# EAGLE schematic tm8_XP1 (EAGLE 9.6.2)
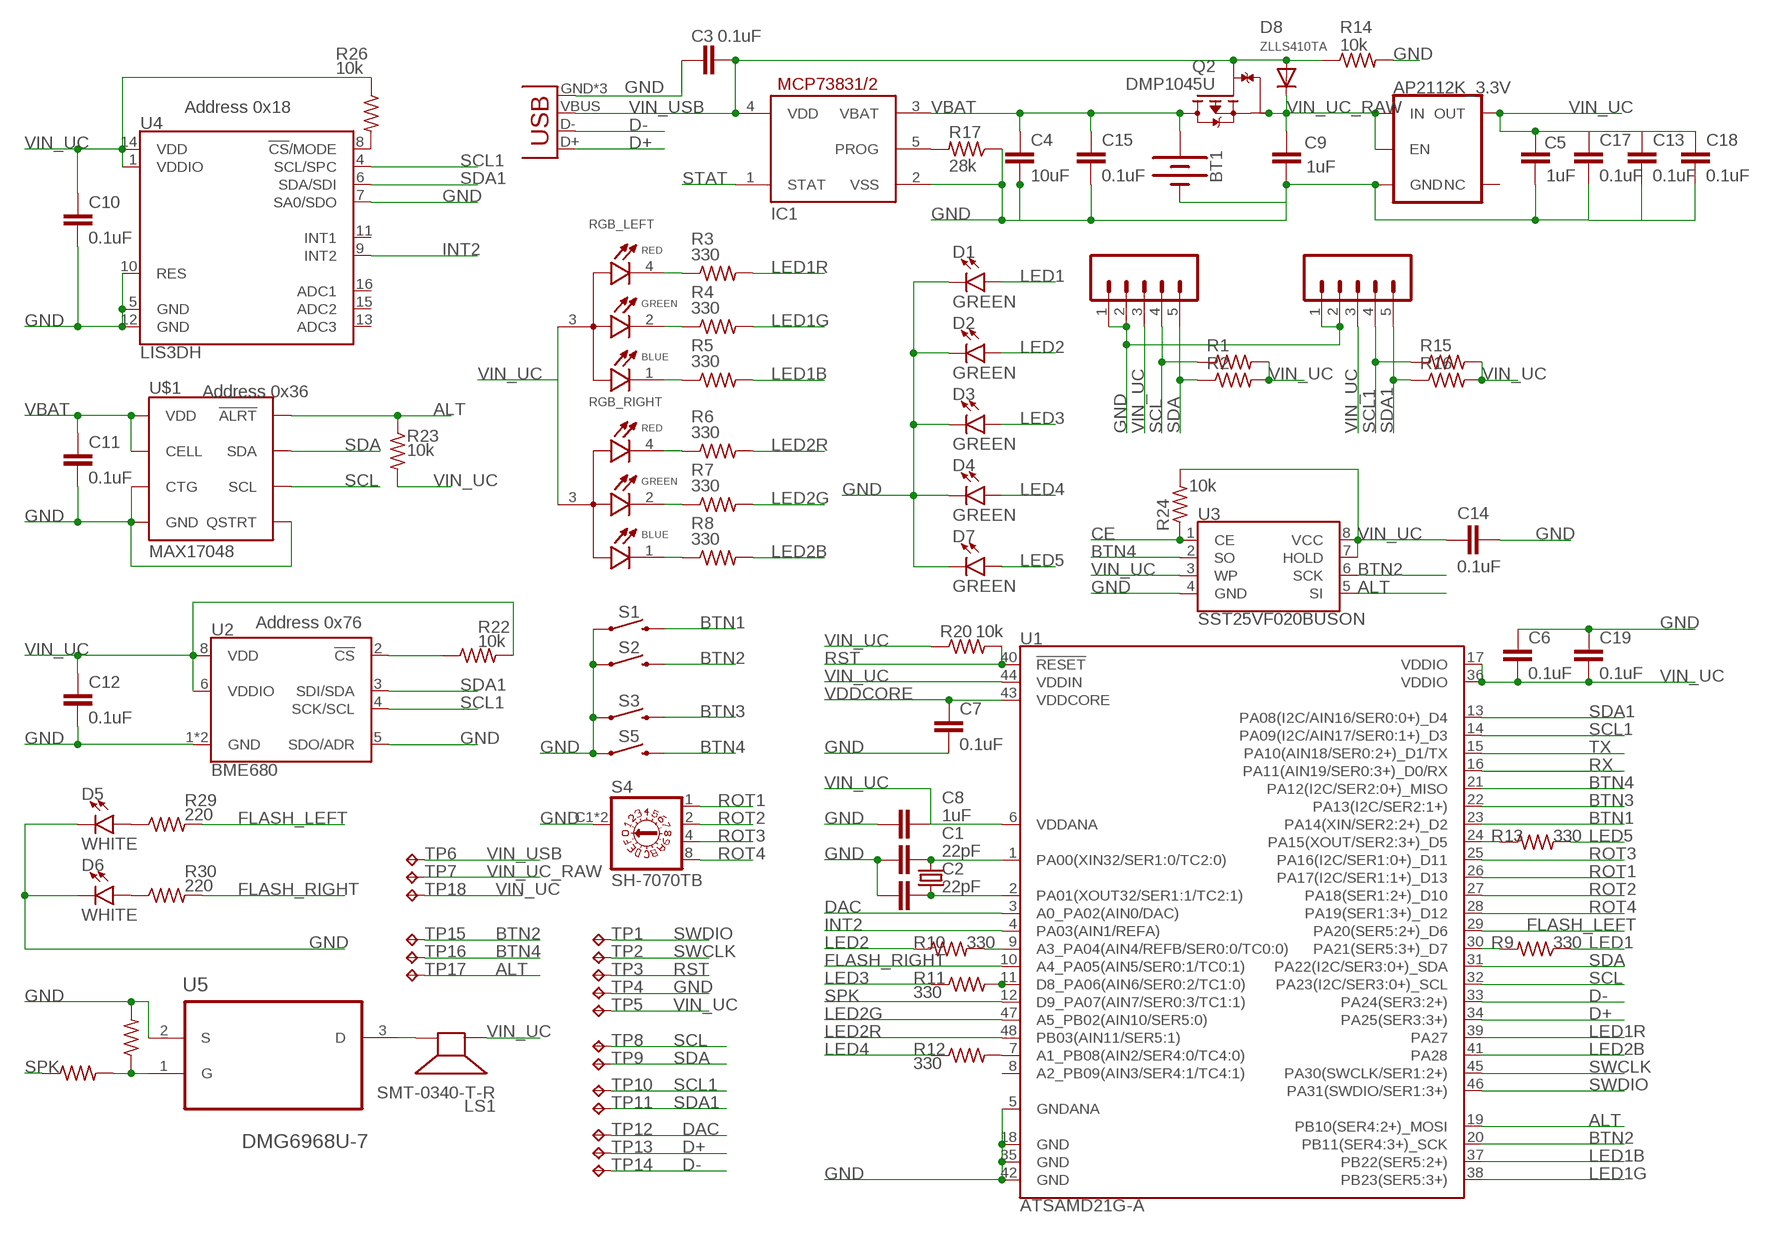
[diagram p0: schematic, sheet 1]

## Parts
AP2112K_3.3V  3.3V  V_REG_AP2112K-3.3V  [SOT23-5]
BT1  BATTERY-20MM_SMD_4LEGS_OVERPASTE_INNER  [BATTCON_20MM_4LEGS_OVERPASTE_INNER]
C1  22pF  C-EUC0402  [C0402]
C2  22pF  C-EUC0402  [C0402]
C3  0.1uF  C-EUC0402  [C0402]
C4  10uF  C-EUC0402  [C0402]
C5  1uF  C-EUC0402  [C0402]
C6  0.1uF  C-EUC0402  [C0402]
C7  0.1uF  C-EUC0402  [C0402]
C8  1uF  C-EUC0402  [C0402]
C9  1uF  C-EUC0402  [C0402]
C10  0.1uF  C-EUC0402  [C0402]
C11  0.1uF  C-EUC0402  [C0402]
C12  0.1uF  C-EUC0402  [C0402]
C13  0.1uF  C-EUC0402  [C0402]
C14  0.1uF  C-EUC0402  [C0402]
C15  0.1uF  C-EUC0402  [C0402]
C17  0.1uF  C-EUC0402  [C0402]
C18  0.1uF  C-EUC0402  [C0402]
C19  0.1uF  C-EUC0402  [C0402]
D1  GREEN  LED-GREEN1206  [LED-1206]
D2  GREEN  LED-GREEN1206  [LED-1206]
D3  GREEN  LED-GREEN1206  [LED-1206]
D4  GREEN  LED-GREEN1206  [LED-1206]
D5  WHITE  LED-WHITE1206  [LED-1206]
D6  WHITE  LED-WHITE1206  [LED-1206]
D7  GREEN  LED-GREEN1206  [LED-1206]
D8  ZLLS410TA  DIODESOD-323F  [SOD-323F]
IC1  MCP73831/OT  [SOT23-5L]
JP2  USB-MICROB  [USB-MICROB]
LCD1  CONN_05VERT_FEMALE_HEADER  [1X05_SMD_VERTICAL_COMBO]
LCD2  CONN_05VERT_FEMALE_HEADER  [1X05_SMD_VERTICAL_COMBO]
LS1  SMT-0340-T-R  [XDCR_SMT-0340-T-R]
Q2  DMP1045U  [SOT91P240X110-3N]
R1  R-US_R0402  [R0402]
R2  R-US_R0402  [R0402]
R3  330  R-US_R0402  [R0402]
R4  330  R-US_R0402  [R0402]
R5  330  R-US_R0402  [R0402]
R6  330  R-US_R0402  [R0402]
R7  330  R-US_R0402  [R0402]
R8  330  R-US_R0402  [R0402]
R9  330  R-US_R0402  [R0402]
R10  330  R-US_R0402  [R0402]
R11  330  R-US_R0402  [R0402]
R12  330  R-US_R0402  [R0402]
R13  330  R-US_R0402  [R0402]
R14  10k  R-US_R0402  [R0402]
R15  R-US_R0402  [R0402]
R16  R-US_R0402  [R0402]
R17  28k  R-US_R0402  [R0402]
R18  220  R-US_R0402  [R0402]
R19  220  R-US_R0402  [R0402]
R20  10k  R-US_R0402  [R0402]
R22  10k  R-US_R0402  [R0402]
R23  10k  R-US_R0402  [R0402]
R24  10k  R-US_R0402  [R0402]
R26  10k  R-US_R0402  [R0402]
R29  220  R-US_R0402  [R0402]
R30  220  R-US_R0402  [R0402]
RGB_LEFT  EAST1616RGBA3  [LED_EAST1616RGBA3]
RGB_RIGHT  EAST1616RGBA3  [LED_EAST1616RGBA3]
S1  MOMENTARY-SWITCH-SPST-SMD-6.0X3.5MM  [TACTILE_SWITCH_SMD_6.0X3.5MM]
S2  MOMENTARY-SWITCH-SPST-SMD-6.0X3.5MM  [TACTILE_SWITCH_SMD_6.0X3.5MM]
S3  MOMENTARY-SWITCH-SPST-SMD-6.0X3.5MM  [TACTILE_SWITCH_SMD_6.0X3.5MM]
S4  SH-7070TB  [SH-7070B]
S5  MOMENTARY-SWITCH-SPST-SMD-6.0X3.5MM  [TACTILE_SWITCH_SMD_6.0X3.5MM]
TP1  TPTP14R  [TP14R]
TP2  TPTP14R  [TP14R]
TP3  TPTP14R  [TP14R]
TP4  TPTP14R  [TP14R]
TP5  TPTP14R  [TP14R]
TP6  TPTP14R  [TP14R]
TP7  TPTP14R  [TP14R]
TP8  TPTP14R  [TP14R]
TP9  TPTP14R  [TP14R]
TP10  TPTP14R  [TP14R]
TP11  TPTP14R  [TP14R]
TP12  TPTP14R  [TP14R]
TP13  TPTP14R  [TP14R]
TP14  TPTP14R  [TP14R]
TP15  TPTP14R  [TP14R]
TP16  TPTP14R  [TP14R]
TP17  TPTP14R  [TP14R]
TP18  TPTP14R  [TP14R]
U1  ATSAMD21G-A  [TQFP-48]
U2  BME680  BME680-LGA  [LGA3.0X3.0]
U3  SST25VF020BUSON  [USON_3X2MM]
U4  LIS3DH  [LGA-16-3X3]
U5  DMG6968U-7  [SOT95P240X110-3N]
U$1  MAX17048  MAX17048DFN8  [DFN-8]
Y1  32.768kHz  CRYSTAL-32.768KHZSMD-3.2X1.5  [CRYSTAL-SMD-3.2X1.5MM]

## Nets
ALT: R23.1 TP17.TP U1.19(PB10(SER4:2+)_MOSI) U3.5(SI) U$1.P$5(!ALRT)
BTN1: S1.2 U1.23(PA14(XIN/SER2:2+)_D2)
BTN2: S2.2 TP15.TP U1.20(PB11(SER4:3+)_SCK) U3.6(SCK)
BTN3: S3.2 U1.22(PA13(I2C/SER2:1+))
BTN4: S5.2 TP16.TP U1.21(PA12(I2C/SER2:0+)_MISO) U3.2(SO)
CE: R24.1 U3.1(CE)
D+: JP2.D+ TP13.TP U1.34(PA25(SER3:3+))
D-: JP2.D- TP14.TP U1.33(PA24(SER3:2+))
DAC: TP12.TP U1.3(A0_PA02(AIN0/DAC))
FLASH_LEFT: R29.2 U1.29(PA20(SER5:2+)_D6)
FLASH_RIGHT: R30.2 U1.10(A4_PA05(AIN5/SER0:1/TC0:1))
GND: AP2112K_3.3V.2(GND) BT1.2(-) C1.1 C2.1 C3.1 C4.2 C5.2 C6.1 C7.2 C8.1 C9.2 C10.2 C11.2 C12.2 C13.2 C14.2 C15.2 C17.2 C18.2 C19.1 D1.C D2.C D3.C D4.C D5.C D6.C D7.C IC1.2(VSS) JP2.GND JP2.MT1(GND) JP2.MT2(GND) LCD1.1 LCD1.2 LCD2.1 LCD2.2 R14.2 R17.1 R19.2 S1.1 S2.1 S3.1 S4.C1(C) S4.C2(C) S5.1 TP4.TP U1.5(GNDANA) U1.18(GND) U1.35(GND) U1.42(GND) U2.1(GND) U2.5(SDO/ADR) U2.7(GND) U3.4(GND) U4.5(GND) U4.7(SA0/SDO) U4.10(RES) U4.12(GND) U5.2(S) U$1.P$1(CTG) U$1.P$4(GND) U$1.P$6(QSTRT) U$1.P$9(GND)
INT2: U1.4(PA03(AIN1/REFA)) U4.9(INT2)
LED1: D1.A R9.1
LED1B: R5.2 U1.37(PB22(SER5:2+))
LED1G: R4.2 U1.38(PB23(SER5:3+))
LED1R: R3.2 U1.39(PA27)
LED2: D2.A R10.1
LED2B: R8.2 U1.41(PA28)
LED2G: R7.2 U1.47(A5_PB02(AIN10/SER5:0))
LED2R: R6.2 U1.48(PB03(AIN11/SER5:1))
LED3: D3.A R11.1
LED4: D4.A R12.1
LED5: D7.A R13.2
N$1: R12.2 U1.7(A1_PB08(AIN2/SER4:0/TC4:0))
N$2: R11.2 U1.11(D8_PA06(AIN6/SER0:2/TC1:0))
N$3: R9.2 U1.30(PA21(SER5:3+)_D7)
N$4: R10.2 U1.9(A3_PA04(AIN4/REFB/SER0:0/TC0:0))
N$5: R3.1 RGB_LEFT.4(R_C)
N$6: R4.1 RGB_LEFT.2(G_C)
N$7: R5.1 RGB_LEFT.1(B_C)
N$8: R6.1 RGB_RIGHT.4(R_C)
N$9: R7.1 RGB_RIGHT.2(G_C)
N$10: R8.1 RGB_RIGHT.1(B_C)
N$11: R13.1 U1.24(PA15(XOUT/SER2:3+)_D5)
N$13: IC1.5(PROG) R17.2
N$15: R22.1 U2.2(!CS)
N$16: D5.A R29.1
N$17: R26.2 U4.8(!CS!/MODE)
N$18: D6.A R30.1
N$21: LS1.N U5.3(D)
N$24: R18.2 R19.1 U5.1(G)
ROT1: S4.1 U1.26(PA17(I2C/SER1:1+)_D13)
ROT2: S4.2 U1.27(PA18(SER1:2+)_D10)
ROT3: S4.4 U1.25(PA16(I2C/SER1:0+)_D11)
ROT4: S4.8 U1.28(PA19(SER1:3+)_D12)
RST: R20.2 TP3.TP U1.40(!RESET!)
RX: U1.16(PA11(AIN19/SER0:3+)_D0/RX)
SCL: LCD1.4 R1.1 TP8.TP U1.32(PA23(I2C/SER3:0+)_SCL) U$1.P$7(SCL)
SCL1: LCD2.4 R15.1 TP10.TP U1.14(PA09(I2C/AIN17/SER0:1+)_D3) U2.4(SCK/SCL) U4.4(SCL/SPC)
SDA: LCD1.5 R2.1 TP9.TP U1.31(PA22(I2C/SER3:0+)_SDA) U$1.P$8(SDA)
SDA1: LCD2.5 R16.1 TP11.TP U1.13(PA08(I2C/AIN16/SER0:0+)_D4) U2.3(SDI/SDA) U4.6(SDA/SDI)
SPK: R18.1 U1.12(D9_PA07(AIN7/SER0:3/TC1:1))
STAT: IC1.1(STAT)
SWCLK: TP2.TP U1.45(PA30(SWCLK/SER1:2+))
SWDIO: TP1.TP U1.46(PA31(SWDIO/SER1:3+))
TX: U1.15(PA10(AIN18/SER0:2+)_D1/TX)
VBAT: BT1.1(+) C4.1 C11.1 C15.1 IC1.3(VBAT) Q2.3(D) U$1.P$2(CELL) U$1.P$3(VDD)
VDDCORE: C7.1 U1.43(VDDCORE)
VIN_UC: AP2112K_3.3V.5(OUT) C5.1 C6.2 C8.2 C10.1 C12.1 C13.1 C14.1 C17.1 C18.1 C19.2 LCD1.3 LCD2.3 LS1.P R1.2 R2.2 R15.2 R16.2 R20.1 R22.2 R23.2 R24.2 R26.1 RGB_LEFT.3(A) RGB_RIGHT.3(A) TP5.TP TP18.TP U1.6(VDDANA) U1.17(VDDIO) U1.36(VDDIO) U1.44(VDDIN) U2.6(VDDIO) U2.8(VDD) U3.3(WP) U3.7(HOLD) U3.8(VCC) U4.1(VDDIO) U4.14(VDD)
VIN_UC_RAW: AP2112K_3.3V.1(IN) AP2112K_3.3V.3(EN) C9.1 D8.C Q2.2(S) TP7.TP
VIN_USB: C3.2 D8.A IC1.4(VDD) JP2.VBUS Q2.1(G) R14.1 TP6.TP
XIN32: C1.2 U1.1(PA00(XIN32/SER1:0/TC2:0)) Y1.P$2
XOUT32: C2.2 U1.2(PA01(XOUT32/SER1:1/TC2:1)) Y1.P$1
Unconnected: AP2112K_3.3V.4(NC) U1.8(A2_PB09(AIN3/SER4:1/TC4:1)) U4.11(INT1) U4.13(ADC3) U4.15(ADC2) U4.16(ADC1)

## Notes on the sheet
- D8 | R14
- C3
- R26
- Address 0x18
- C9 | C5
- Address 0x36
- R23
- Address 0x76 | R22
- R29
- R13
- TP6
- R30 | TP7
- TP18
- TP15
- R10 | R9
- TP16
- TP17
- R11
- TP8
- R12
- TP9
- TP10
- TP11
- TP12
- TP13
- TP14

## Library data of the parts
AP2112K_3.3V = SparkFun-IC-Power:V_REG_AP2112: AP2112 - 600mA CMOS LDO Regulator w/ Enable The AP2112 is CMOS process low dropout linear regulator with enable function, the regulator delivers a guaranteed 600mA (min.) continuous load current. Features Output Voltage Accuracy: ±1.5% Output Current: 600mA (Min.) Foldback Short Current Protection: 50mA Enable Function to Turn ON/OFF VOUT Low Dropout Voltage (3.3V): 250mV (Typ.) @IOUT=600mA Excellent Load Regulation: 0.2%/A (Typ.) Excellent Line Regulation: 0.02%/V (Typ.) Low Quiescent Current: 55μA (Typ.) Low Standby Current: 0.01μA (Typ.) Low Output Noise: 50μVRMS PSRR: 100Hz -65dB, 1kHz -65dB OTSD Protection Stable with 1.0μF Flexible Cap: Ceramic, Tantalum and Aluminum Electrolytic Operation Temperature Range: -40°C to 85°C ESD: MM 400V, HBM 4000V; PROD_ID: VREG-12457
BT1 = SparkFun-Batteries:BATTERY: Battery - Single Cell A variety of battery chemistries, sizes, and footprints. Device List: 20MM_PTH - Coin Cell Battery Holder - 20mm (PTH) <https://www.sparkfun.com/products/783> 20MM_PTH_KIT- Coin Cell battery Holder - 20 mm (PTH) <http://www.sparkfun.com/products/783>kit version with special mask 6.8MM_PTH - Coin Cell Battery Holder - 6.8MM(SMD) <https://www.digikey.com/product-detail/en/seiko-instruments/MS621FE-FL11E/728-1057-ND/1889208?WT.srch=1&gclid=CNOQ5a6LzdQCFZS2wAodXCkE0g> 12MM_SMD - Coin Cell Battery Holder - 12mm (SMD) <https://www.sparkfun.com/products/10592> 12MM_PTH - Coin Cell Battery Holder - 12mm (PTH) <https://www.sparkfun.com/products/7948> 20MM_SMD - 20mm Coin Cell Battery Holder (SMD) (2 legs) Used on the Big Time Watch Kit <https://www.sparkfun.com/products/11734> 20MM_SMD_4LEGS - Coin Cell Battery Holder - 20mm (SMD) <https://www.sparkfun.com/products/11892> 20MM_SMD_4LEGS_OVERPASTE - Coin Cell Battery Holder - 20mm (SMD) <https://www.sparkfun.com/products/11892> (Over-paste on the legs) 24.5MM_PTH - Coin Cell Battery Holder - 24.5mm (PTH) <https://www.sparkfun.com/products/8863> 9V - 9V Battery Holder - PC Mount Used on the SparkFun SparkPunk Sound Kit <https://www.sparkfun.com/products/11177> and SparkFun SparkPunk Sequencer Kit <https://www.sparkfun.com/products/12707> 18650 - Battery Holder - 18650 (PTH) <https://www.sparkfun.com/products/13113> AA - Battery Holder - 1xAA (PTH) <https://www.sparkfun.com/products/7949> AAA - Battery Holder - 1xAAA (PTH) <https://www.sparkfun.com/products/12718> AA_KIT - Battery Holder - 1xAA (PTH) <https://www.sparkfun.com/products/7949> Special kit package - pads only have exposed copper on one side of the board. AAA_KIT - Battery Holder - 1xAAA (PTH) <https://www.sparkfun.com/products/12718> Special kit package - pads only have exposed copper on one side of the board.
C1-C15 C17-C19 = rcl:C-EU: CAPACITOR, European symbol; SPICEPREFIX: C
D1-D4 D7 = SparkFun-LED:LED-GREEN: Green SMD LED Used in manufacturing of various products at SparkFun Packages: 0603 - SMD 0603 package [Product Link] <http://www.futureelectronics.com/en/technologies/semiconductors/optoelectronics/leds/Pages/9894312-LTST-C190GKT.aspx?CrossPart=HSMG-C190&IM=0> LilyPad 1206 - SMD1206 LilyPad package [Product Link] <http://www.futureelectronics.com/en/Technologies/Product.aspx?ProductID=IN150NGHARVATEKCORPORATION2049943&IM=0> 1206 - SMD1206 package [Product Link] <http://www.futureelectronics.com/en/technologies/semiconductors/optoelectronics/leds/Pages/8315665-LTST-C150KGKT.aspx?IM=0> 1206 Bottom Mount -SMD 1206 Bottom Mount [Product Link] <http://www.digikey.com/product-detail/en/lite-on-inc/LTST-C230KGKT/160-1456-1-ND/386854> SparkFun Products: Pro Mini 328 -5V <https://www.sparkfun.com/products/821> RedBoard <https://www.sparkfun.com/products/12757> MP3 Trigger <https://www.sparkfun.com/products/13720> Makey Makey <https://www.sparkfun.com/products/11076>; PROD_ID: DIO-00862
D5 D6 = SparkFun-LED:LED-WHITE: White SMD LED Used in manufacturing several products at SparkFun. Packages: 0603 - Bright White SMD 0603 package[Product Link] <http://www.kingbrightusa.com/product.asp?catalog_name=LED&product_id=APT1608QWF/D> 1206 - Bright White SMD1206 package [Product Link] <http://www.kingbrightusa.com/product.asp?catalog_name=LED&product_id=APT3216QWF/D> 3014 - Super Bright SMD 3014 package [Datasheet] <http://www.lumileds.com/uploads/459/DS208-pdf> SparkFun Products: Blackberry Trackballer Breakout <https://www.sparkfun.com/products/13169> Digital SandBox <https://www.sparkfun.com/products/12651>; PROD_ID: DIO-09955
D8 = adafruit:DIODE: Diode SMADIODE - SMA Surface Mount Package 20V 1A Schottky Diode Digikey: 641-1014-6-ND DO-1N4148 - Through Hole Small Current Diode SOD-123 20V 1 A (.5mV Vf) Schottky Diode - Digikey: MBRX120TPMSCT-ND SOD-323 10V 570mA (.38mV Vf, 3ns) Schottky Diode - Digikey: ZLLS410CT-ND SOD-523 30V 30mA Schottky Diode (RB751S-40TE61) - Digikey: RB751S-40TE61CT-ND SOT23-R/W - SOT23 Package (R = Solder Paste/Reflow Ovens, W = Hand-Soldering) BAT54Film 40V 300mA - Digikey: 497-7162-1-ND
IC1 = adafruit:MCP73831: MCP73831/2 Miniature Single-Cell, Fully Integrated Li-Ion, Li-Polymer Charge Management Controllers. Nice and small simple lipoly charge controller, with adjustable current and status output (LED) http://www.ladyada.net/library/pcb/eaglelibrary.html
JP2 = Feesta-parts:USB: USB Connectors USB-B-PTH is fully proven SKU : PRT-00139/CONN-08278 USB-miniB is fully proven SKU : PRT-00587 USB-A-PCB is untested. USB-A-H is throughly reviewed, but untested. Spark Fun Electronics SKU : PRT-00437 USB-B-SMT is throughly reviewed, but untested. Needs silkscreen touching up. USB-A-S has not been used/tested USB-MB-H has not been used/tested USB-MICROB has been used. CONN-09505; PROD_ID: CONN-09505
LCD1 LCD2 = SparkFun-Connectors:CONN_05: Multi connection point. Often used as Generic Header-pin footprint for 0.1 inch spaced/style header connections On any of the 0.1 inch spaced packages, you can populate with these: Break Away Headers - Straight <https://www.sparkfun.com/products/116> (PRT-00116) Break Away Male Headers - Right Angle <https://www.sparkfun.com/products/553> (PRT-00553) Female Headers <https://www.sparkfun.com/products/115> (PRT-00115) Break Away Headers - Machine Pin <https://www.sparkfun.com/products/117> (PRT-00117) Break Away Female Headers - Swiss Machine Pin <https://www.sparkfun.com/products/743> (PRT-00743) For SCREWTERMINALS and SPRING TERMINALS visit here: Screw Terimnals on SparkFun.com <https://www.sparkfun.com/search/results?term=Screw+Terminals> (5mm/3.5mm/2.54mm spacing) This device is also useful as a general connection point to wire up your design to another part of your project. Our various solder wires solder well into these plated through hole pads. Hook-Up Wire - Assortment (Stranded, 22 AWG) <https://www.sparkfun.com/products/11375> (PRT-11375) Hook-Up Wire - Assortment (Solid Core, 22 AWG) <https://www.sparkfun.com/products/11367> (PRT-11367) View the entire wire category on our website here <https://www.sparkfun.com/categories/141> Special notes: Molex polarized connector foot print use with SKU : PRT-08231 with associated crimp pins and housings. 1MM SMD Version SKU: PRT-10208; PROD_ID: CONN-15262
LS1 = SMT-0340-T-R:SMT-0340-T-R; MANUFACTURER: Pui Audio; MAXIMUM_PACKAGE_HEIGHT: 2.00 mm; PARTREV: 3/10/2020; STANDARD: Manufacturer Recomemndations
Q2 = DMP1045U:DMP1045U: P-Channel 12V 4A (Ta) 800mW (Ta) Surface Mount SOT-23 Check availability <https://pricing.snapeda.com/parts/DMP1045U/Diodes%20Inc./view-part?ref=eda>; AVAILABILITY: In Stock; DESCRIPTION: P-Channel 12 V 2.6A (Ta) 530mW Surface Mount X2-WLB0808-4 (Type C); MF: Diodes Inc.; MP: DMP1045U; PACKAGE: SOT-23 Diodes Inc.; PRICE: None; PURCHASE-URL: https://pricing.snapeda.com/search/part/DMP1045U/?ref=eda
R1 R2 R14-R17 R20 = adafruit:R-US_: RESISTOR, American symbol
R3-R13 R18 R19 R22-R24 R26 R29 R30 = rcl:R-US_: RESISTOR, American symbol; SPICEPREFIX: R
RGB_LEFT RGB_RIGHT = EAST1616RGBA3:EAST1616RGBA3: Red, Green, Blue (RGB) LED Indication - Discrete 1.95V Red, 2.8V Green, 2.8V Blue 0606 (1616 Metric) Check availability <https://pricing.snapeda.com/parts/EAST1616RGBA3/Everlight%20Electronics/view-part?ref=eda>; AVAILABILITY: In Stock; DESCRIPTION: Red, Green, Blue (RGB) - LED Indication - Discrete 1.95V Red, 2.8V Green, 2.8V Blue 0606 (1616 Metric); MF: Everlight Electronics; MP: EAST1616RGBA3; PACKAGE: 0606 Everlight; PRICE: None; PURCHASE-URL: https://pricing.snapeda.com/search/part/EAST1616RGBA3/?ref=eda
S1-S3 S5 = SparkFun-Switches:MOMENTARY-SWITCH-SPST: Momentary Switch (Pushbutton) - SPST Normally-open (NO) SPST momentary switches (buttons, pushbuttons). Variants PTH-12MM - 12mm square, through-hole Momentary Pushbutton Switch - 12mm Square <https://www.sparkfun.com/products/9190> (COM-09190) PTH-6.0MM, PTH-6.0MM-KIT - 6.0mm square, through-hole Mini Pushbutton Switch <https://www.sparkfun.com/products/97> (COM-00097) KIT package intended for soldering kit's - only one side of pads' copper is exposed. PTH-RIGHT-ANGLE-KIT - Right-angle, through-hole Right Angle Tactile Button <https://www.sparkfun.com/products/10791> - Used on SparkFun BigTime Watch Kit <https://www.sparkfun.com/products/11734> SMD-12MM - 12mm square, surface-mount Tactile Button - SMD (12mm) <https://www.sparkfun.com/products/12993> (COM-12993) Used on SparkFun PicoBoard <https://www.sparkfun.com/products/11888> SMD-4.5MM - 4.5mm Square Trackball Switch Used on SparkFun Blackberry Trackballer Breakout <https://www.sparkfun.com/products/13169> SMD-4.6MMX2.8MM - 4.60mm x 2.80mm, surface mount Used on SparkFun Pro Micro - RP2040 <https://www.sparkfun.com/products/17717> SMD-5.2MM, SMD-5.2-REDUNDANT - 5.2mm square, surface-mount Mini Pushbutton Switch - SMD <https://www.sparkfun.com/products/8720> (COM-08720) Used on Arduino Pro Mini <https://www.sparkfun.com/products/11114> REDUNDANT package connects both switch circuits together SMD-6.0X3.5MM - 6.0 x 3.5mm, surface mount Momentary Reset Switch SMD <https://www.sparkfun.com/products/8229> (COM-08229) SMD-6.2MM-TALL - 6.2mm square, surface mount Tactile Button - SMD (6mm) <https://www.sparkfun.com/products/12992> Used on SparkFun Digital Sandbox <https://www.sparkfun.com/products/12651> SMD-RIGHT-ANGLE - Right-angle, surface mount Used on SparkFun Block for Intel® Edison - Arduino <https://www.sparkfun.com/products/13036>; PROD_ID: SWCH-14278; SF_SKU: COM-08229
S4 = SH-7070TB:SH-7070TB: ROTARY CODED HEX SWITCH Check availability <https://pricing.snapeda.com/parts/SH-7070TB/Nidec%20Copal/view-part?ref=eda>; AVAILABILITY: In Stock; DESCRIPTION: Dip Switch Hexadecimal Complement 16 Position Surface Mount Rotary for Tool Actuator 100mA 5VDC; MF: Nidec Copal; MP: SH-7070TB; PACKAGE: None; PRICE: None; PURCHASE-URL: https://pricing.snapeda.com/search/part/SH-7070TB/?ref=eda
TP1-TP18 = testpad:TP: Test pad
U1 = SparkFun-IC-Microcontroller:ATSAMD21G: Atmel SAMD21G SMART ARM-Based Microcontroller The Atmel ® | SMART ™ SAM D21 is a series of low-power microcontrollers using the 32-bit ARM ® Cortex ® -M0+ processor, and ranging from 32- to 64-pins with up to 256KB Flash and 32KB of SRAM. The SAM D21 devices operate at a maximum frequency of 48MHz and reach 2.46 CoreMark/MHz. They are designed for simple and intuitive migration with identical peripheral modules, hex compatible code, identical linear address map and pin compatible migration paths between all devices in the product series. All devices include intelligent and flexible peripherals, Atmel Event System for inter-peripheral signaling, and support for capacitive touch button, slider and wheel user interfaces. Datasheet <https://cdn.sparkfun.com/datasheets/Dev/Arduino/Boards/Atmel-42181-SAM-D21_Datasheet.pdf> SparkFun Products SparkFun SAMD21 Mini Breakout <https://www.sparkfun.com/products/13664> (DEV-13664) SparkFun SAMD21 Dev Breakout <https://www.sparkfun.com/products/13672> (DEV-13672) (DEV-14926); PROD_ID: IC-13064
U2 = SparkFun-Sensors:BME680: Bosch BME680 – Combined Humidity and Pressure Sensor The BME680 is as combined digital humidity, pressure and temperature sensor based on proven sensing principles. The sensor module is housed in an extremely compact metal-lid LGA package with a footprint of only 3.0×3.0mm with a height of 0.93mm. Its small dimensions and its low power consumption allow the implementation in battery driven devices such as handsets, GPS modules or watches.; PROD_ID: IC-14656
U3 = SparkFun-IC-Memory:SST25VF020B: 2Mbit Serial Flash Memory 8pin SPI Flash Datasheet <http://ww1.microchip.com/downloads/en/DeviceDoc/20005054D.pdf>; DIGIKEY_PART: SST25VF020B-80-4I-Q3AE-TCT-ND; MANU_PART: SST25VF020B-80-4I-Q3AE-T; PROD_ID: IC-15716
U4 = SparkFun-Sensors:LIS3DH: ST Microelectronics LIS3DH 3-Axis ±2/4/8/16g SPI/I2C Accelerometer The LIS3DH is a three axis MEMS linear accelerometer in the "nano" family. It has a digital I2C/SPI serial interface which makes it ideal for using in embedded applications. The device also features ultra low-power operational modes that allow advanced power saving and smart sleep to wake-up functions, built in detections with interrupts, and auxiliary ADC inputs Datasheet-XXXX <http://www.sparkfun.com/datasheets/Sensors/Accelerometer/LIS3DH.pdf> SparkFun Products SparkFun Triple Axis Accelerometer Breakout - LIS3DH <https://www.sparkfun.com/products/10345> (SEN-XXXXX) Triple Axis Accelerometer - LIS3DH <https://www.sparkfun.com/products/9755> (SEN-XXXXX); PROD_ID: IC-13419; SF_ID: N/A
U5 = DMG6968U-7:DMG6968U-7: N-CHANNEL ENHANCEMENT MODE MOSFET Check availability <https://pricing.snapeda.com/parts/DMG6968U-7/Diodes%20Inc./view-part?ref=eda>; AVAILABILITY: In Stock; DESCRIPTION: N-Channel 20 V 6.5A (Ta) 1.3W (Ta) Surface Mount SOT-23-3; MF: Diodes Inc.; MP: DMG6968U-7; PACKAGE: SOT-23 Diodes Inc.; PRICE: None; PURCHASE-URL: https://pricing.snapeda.com/search/part/DMG6968U-7/?ref=eda
U$1 = SparkFun-IC-Power:MAX17048: Micropower 1-Cell Li+ ModelGauge SparkFun Products Qduino Mini <https://www.sparkfun.com/products/13614> (DEV-13614); PROD_ID: IC-12551
Y1 = SparkFun-Clocks:CRYSTAL-32.768KHZ: 32.768kHz Crystal Frequency: 32.768kHz Frequency Stability: ±20ppm Load Capacitance: 12.5pF (PTH-2X6 & SMD-3.2X1.5), 6pF (SMD-2X6) SparkFun Products: SparkFun BigTime Watch Kit <https://www.sparkfun.com/products/11734> SparkFun nRF52832 Breakout <https://www.sparkfun.com/products/13990> SparkFun Real Time Clock Module <https://www.sparkfun.com/products/12708>; PROD_ID: XTAL-13062